# Altium schematic sheet 34. USB TYPE C 3.0.SchDoc: USB 3.0 TYPE C INTERFACE
size 513 x 386 mm; Project: PROC154E2(001)_SK_AM69; Issue: 1.0; RevCode: E3; Page Create Date: March  8, 1995; Variant Name: Core Design; Schematic Page Number: 34; Page Number: 34; Page Size: C; Comment: MISTRAL_TITLEBLK_CSIZE_1; Page Count: 62; Schematic Page Count: 62; Name: PROC154E2 001 SK AM69; DsnPath: C:\Users\danie\Downloads\sprr466c\PROC154E3_RP\PROC154E3_SCH.DSN; SchematicName: SCHEMATIC1; PageName: 34. USB TYPE C 3.0; PageSize: C; TopSchematic: True
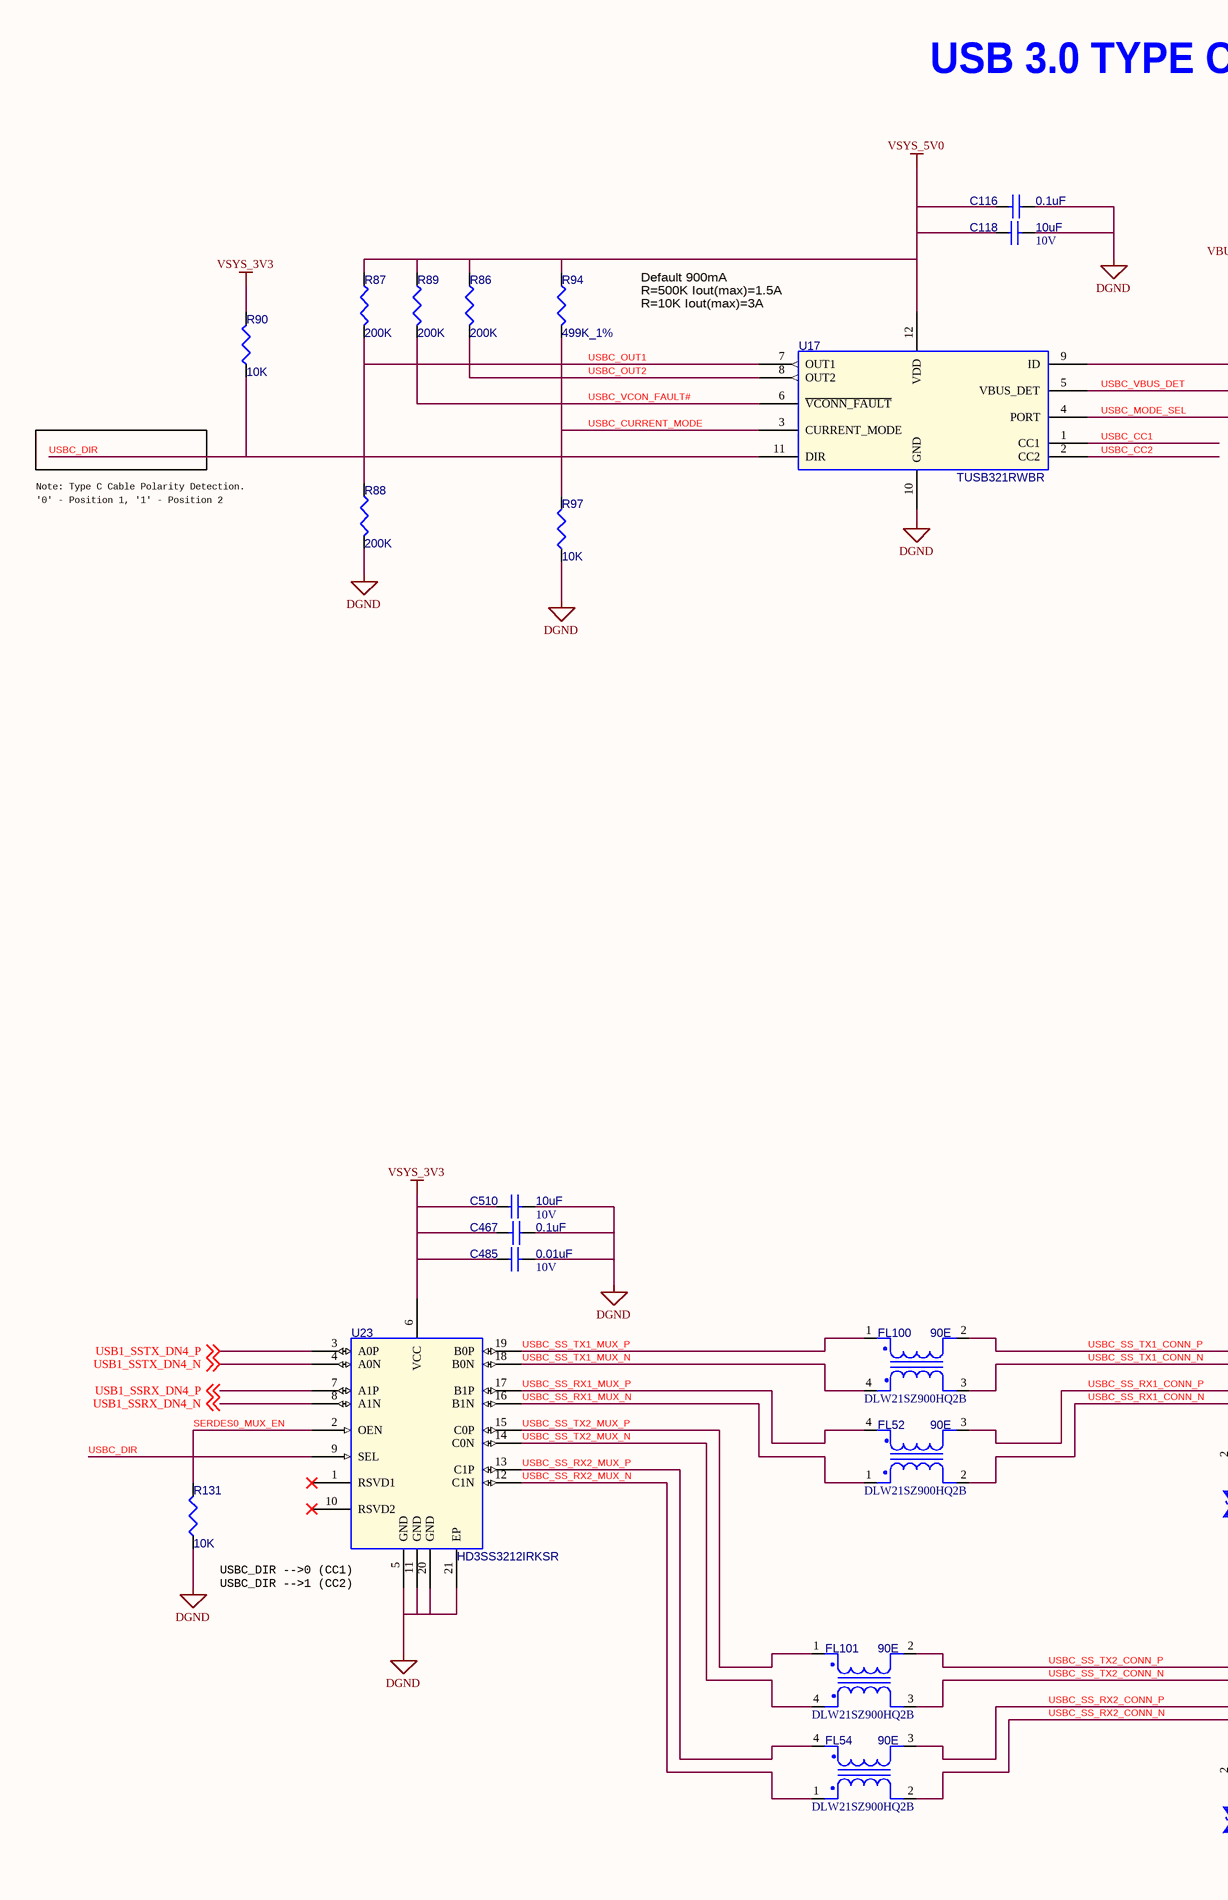
[diagram p0: 34. USB TYPE C 3.0.SchDoc, left]
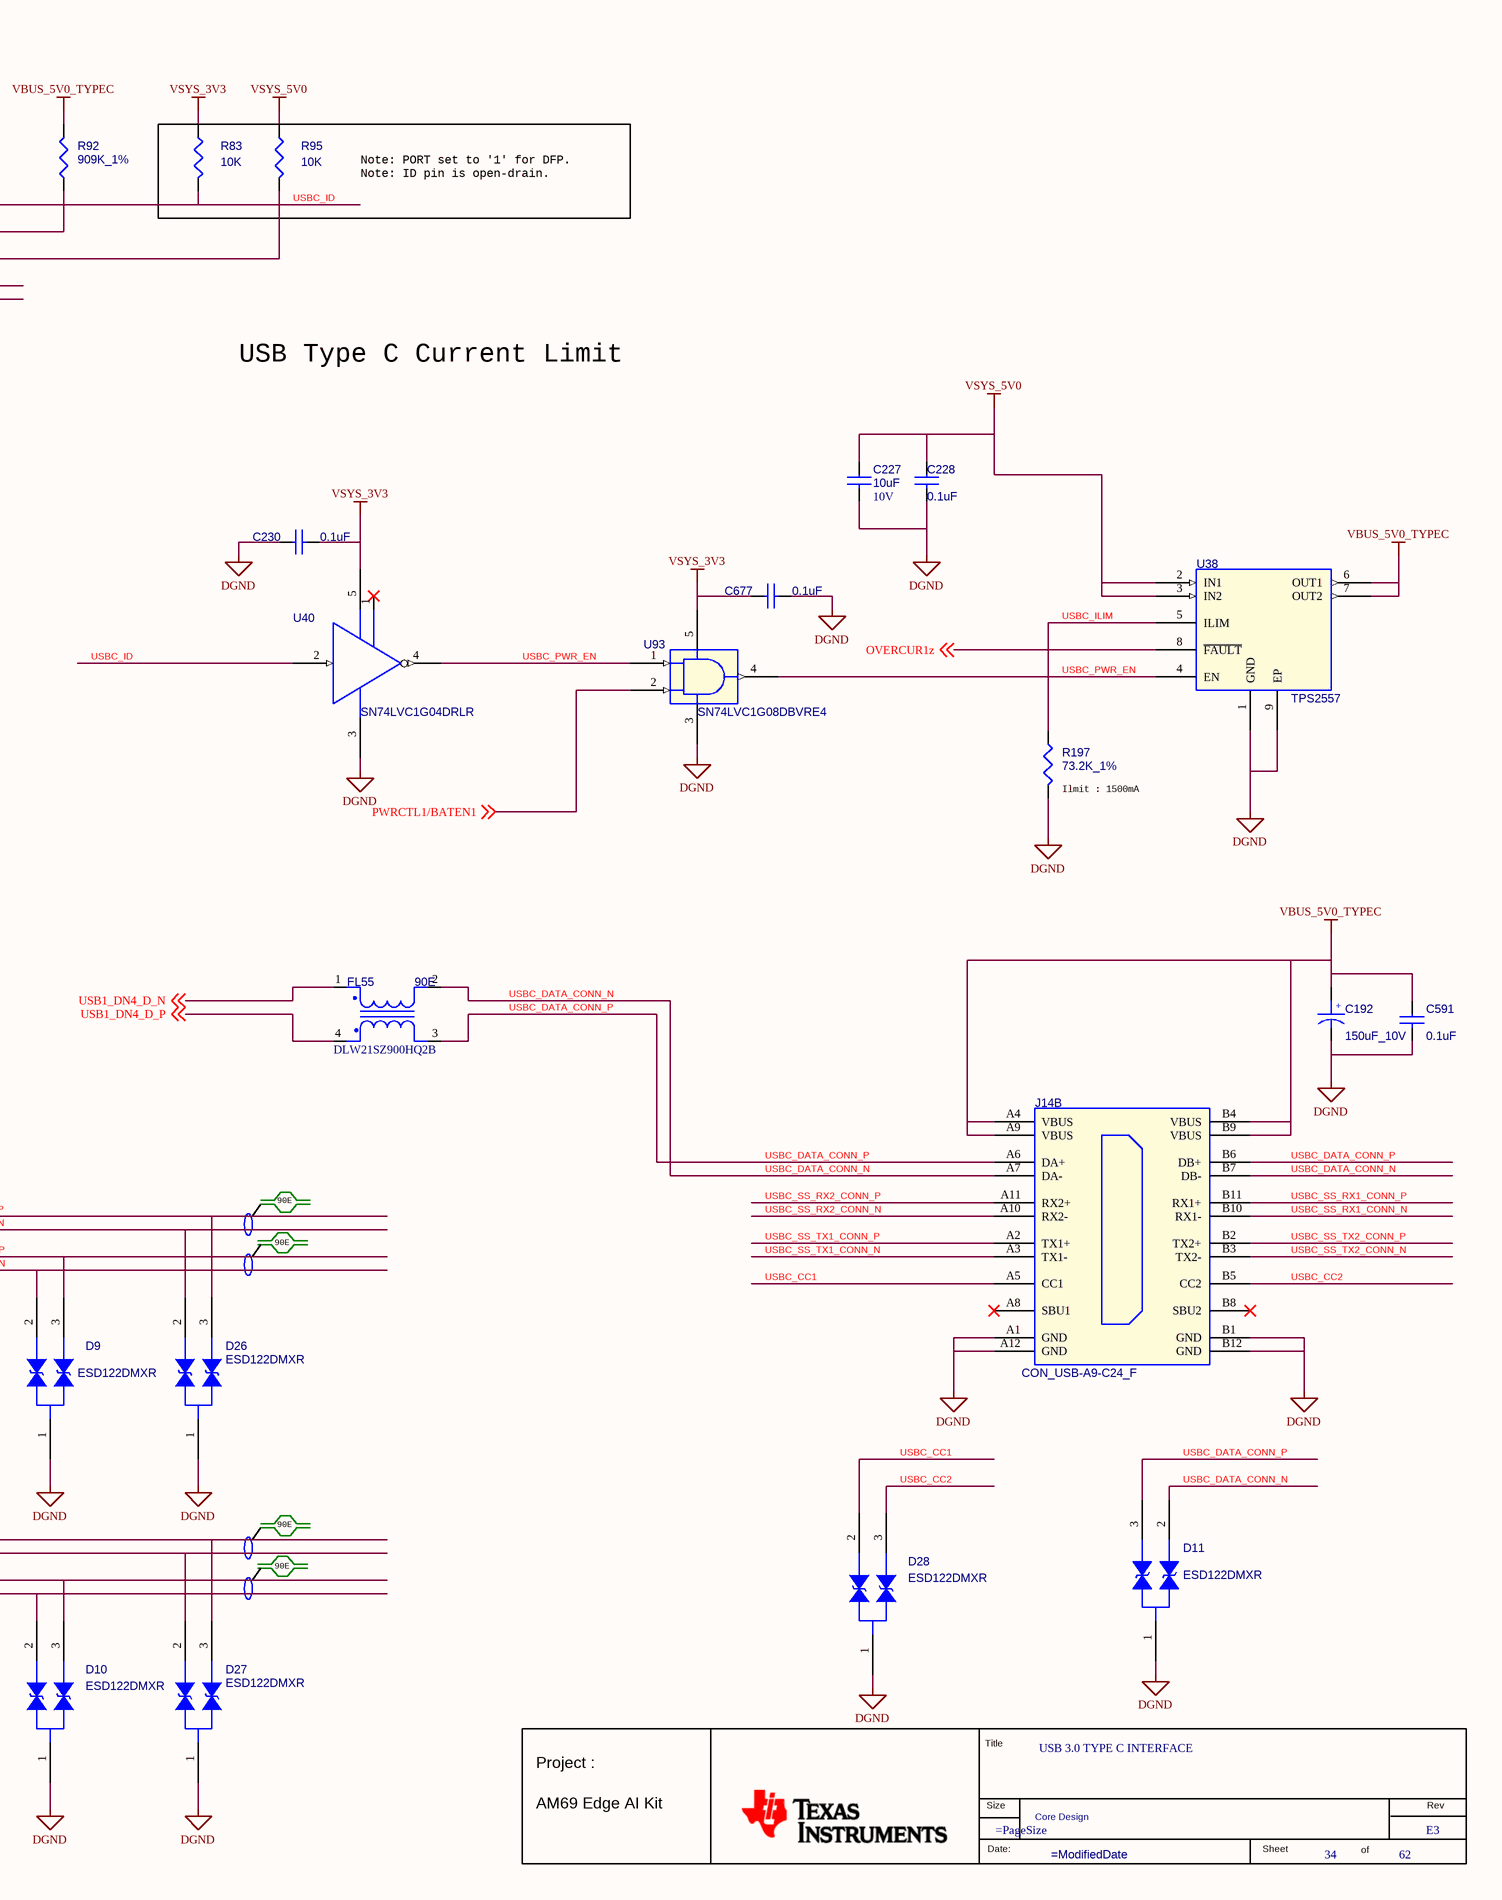
[diagram p1: 34. USB TYPE C 3.0.SchDoc, right]

## Parts
*  RevCode: E3  Title: USB 3.0 TYPE C INTERFACE  Page Number: 34  Page Count: 62  Variant Name: Core Design  (hidden comment: MISTRAL_TITLEBLK_CSIZE_1)  (graphical)
C116  0.1uF  [CAP0201_0-5]
C118  10uF  Voltage: 10V  [CAP0402_1]
C192  150uF_10V  [CAPT3528B_2-25]
C227  10uF  Voltage: 10V  [CAP0402_1]
C228  0.1uF  [CAP0201_0-5]
C230  0.1uF  [CAP0201_0-5]
C467  0.1uF  [CAP0201_0-5]
C485  0.01uF  Voltage: 10V  [CAP0201_0-5]
C510  10uF  Voltage: 10V  [CAP0402_1]
C591  0.1uF  [CAP0201_0-5]
C677  0.1uF  [CAP0201_0-5]
D9  ESD122DMXR  [X2SON3_ESD122DMX_30X40_0-4]
D10  ESD122DMXR  [X2SON3_ESD122DMX_30X40_0-4]
D11  ESD122DMXR  [X2SON3_ESD122DMX_30X40_0-4]
D26  ESD122DMXR  [X2SON3_ESD122DMX_30X40_0-4]
D27  ESD122DMXR  [X2SON3_ESD122DMX_30X40_0-4]
D28  ESD122DMXR  [X2SON3_ESD122DMX_30X40_0-4]
FL52  90E  Mfr_part_number: DLW21SZ900HQ2B  [IND4_DLW21H_90X60_SMD_1-4]
FL54  90E  Mfr_part_number: DLW21SZ900HQ2B  [IND4_DLW21H_90X60_SMD_1-4]
FL55  90E  Mfr_part_number: DLW21SZ900HQ2B  [IND4_DLW21H_90X60_SMD_1-4]
FL100  90E  Mfr_part_number: DLW21SZ900HQ2B  [IND4_DLW21H_90X60_SMD_1-4]
FL101  90E  Mfr_part_number: DLW21SZ900HQ2B  [IND4_DLW21H_90X60_SMD_1-4]
J14  CON_USB-A9-C24_F  [CON_USBAC33_USB-A3-C31-D-RA-CS1_S_R_T_15-9]  (part B of 2)
R83  10K  [RES0402_0-5]
R86  200K  [RES0402_0-5]
R87  200K  [RES0402_0-5]
R88  200K  [RES0402_0-5]
R89  200K  [RES0402_0-5]
R90  10K  [RES0201_0-5]
R92  909K_1%  [RES0402_0-5]
R94  499K_1%  [RES0402_0-5]
R95  10K  [RES0402_0-5]
R97  10K  [RES0402_0-5]
R131  10K  [RES0402_0-5]
R197  73.2K_1%  [RES0402_0-5]
U17  TUSB321RWBR  [X2QFN12_TUSB322I_60X60_0-4]
U23  HD3SS3212IRKSR  [VQFN20_HD3SS3212_100X180_1]
U38  TPS2557  [SON8_25-59_130X130_1]
U40  SN74LVC1G04DRLR  [SOT553-5]
U93  SN74LVC1G08DBVRE4  [SOT23-5]

## Nets
DGND: C116.1 C118.2 C192.2 C227.2 C228.2 C230.1 C467.1 C485.2 C510.2 C591.2 C677.2 D9.1(GND) D10.1(GND) D11.1(GND) D26.1(GND) D27.1(GND) D28.1(GND) J14.A1(GND) J14.A12(GND) J14.B1(GND) J14.B12(GND) R88.2 R97.1 R131.1 R197.2 U17.10(GND) U23.5(GND) U23.11(GND) U23.20(GND) U23.21(EP) U38.1(GND) U38.9(EP) U40.3(GND) U93.3(GND)
VBUS_5V0_TYPEC: C192.1 C591.1 J14.A4(VBUS) J14.A9(VBUS) J14.B4(VBUS) J14.B9(VBUS) R92.2 U38.6(OUT1) U38.7(OUT2)
VSYS_3V3: C230.2 C467.2 C485.1 C510.1 C677.1 R83.1 R90.2 U23.6(VCC) U40.5(VCC) U93.5(VCC)
VSYS_5V0: C116.2 C118.1 C227.1 C228.1 R86.1 R87.1 R89.1 R94.1 R95.1 U17.12(VDD) U38.2(IN1) U38.3(IN2)
OVERCUR1z: U38.8(~{FAULT}) ; off-sheet OVERCUR1z
PWRCTL1/BATEN1: U93.2(B) ; off-sheet PWRCTL1/BATEN1
SERDES0_MUX_EN: R131.2 U23.2(OEN)
USB1_DN4_D_N: FL55.1(IN1) ; off-sheet USB1_DN4_D_N
USB1_DN4_D_P: FL55.4(OUT2) ; off-sheet USB1_DN4_D_P
USB1_SSRX_DN4_N: U23.8(A1N) ; off-sheet USB1_SSRX_DN4_N
USB1_SSRX_DN4_P: U23.7(A1P) ; off-sheet USB1_SSRX_DN4_P
USB1_SSTX_DN4_N: U23.4(A0N) ; off-sheet USB1_SSTX_DN4_N
USB1_SSTX_DN4_P: U23.3(A0P) ; off-sheet USB1_SSTX_DN4_P
USBC_CC1: D28.2(IO1) J14.A5(CC1) U17.1(CC1)
USBC_CC2: D28.3(IO2) J14.B5(CC2) U17.2(CC2)
USBC_CURRENT_MODE: R94.2 R97.2 U17.3(CURRENT_MODE)
USBC_DATA_CONN_N: D11.2(IO1) FL55.2(IN2) J14.A7(DA-) J14.B7(DB-)
USBC_DATA_CONN_P: D11.3(IO2) FL55.3(OUT1) J14.A6(DA+) J14.B6(DB+)
USBC_DIR: R90.1 U17.11(DIR) U23.9(SEL)
USBC_ID: R83.2 U17.9(ID) U40.2(A)
USBC_ILIM: R197.1 U38.5(ILIM)
USBC_MODE_SEL: R95.2 U17.4(PORT)
USBC_OUT1: R87.2 R88.1 U17.7(OUT1)
USBC_OUT2: R86.2 U17.8(OUT2)
USBC_PWR_EN: U38.4(EN) U40.4(Y) U93.1(A) U93.4(Y)
USBC_SS_RX1_CONN_N: D9.2(IO1) FL52.2(IN2) J14.B10(RX1-)
USBC_SS_RX1_CONN_P: D9.3(IO2) FL52.3(OUT1) J14.B11(RX1+)
USBC_SS_RX1_MUX_N: FL52.1(IN1) U23.16(B1N)
USBC_SS_RX1_MUX_P: FL52.4(OUT2) U23.17(B1P)
USBC_SS_RX2_CONN_N: D10.2(IO1) FL54.2(IN2) J14.A10(RX2-)
USBC_SS_RX2_CONN_P: D10.3(IO2) FL54.3(OUT1) J14.A11(RX2+)
USBC_SS_RX2_MUX_N: FL54.1(IN1) U23.12(C1N)
USBC_SS_RX2_MUX_P: FL54.4(OUT2) U23.13(C1P)
USBC_SS_TX1_CONN_N: D26.2(IO1) FL100.3(OUT1) J14.A3(TX1-)
USBC_SS_TX1_CONN_P: D26.3(IO2) FL100.2(IN2) J14.A2(TX1+)
USBC_SS_TX1_MUX_N: FL100.4(OUT2) U23.18(B0N)
USBC_SS_TX1_MUX_P: FL100.1(IN1) U23.19(B0P)
USBC_SS_TX2_CONN_N: D27.2(IO1) FL101.3(OUT1) J14.B3(TX2-)
USBC_SS_TX2_CONN_P: D27.3(IO2) FL101.2(IN2) J14.B2(TX2+)
USBC_SS_TX2_MUX_N: FL101.4(OUT2) U23.14(C0N)
USBC_SS_TX2_MUX_P: FL101.1(IN1) U23.15(C0P)
USBC_VBUS_DET: R92.1 U17.5(VBUS_DET)
USBC_VCON_FAULT#: R89.2 U17.6(~{VCONN_FAULT})

Not connected (* = marked no-connect by the designer): J14 A8(SBU1)* B8(SBU2)*; U23 1(RSVD1)* 10(RSVD2)*; U40 1(NC)*

## Notes on the sheet
- USB 3.0 TYPE C INTERFACE
- R=500K Iout(max)=1.5A
- R=10K Iout(max)=3A
- Default 900mA
- Note: PORT set to '1' for DFP.
  Note: ID pin is open-drain.
- Note: Type C Cable Polarity Detection.
- '0' - Position 1, '1' - Position 2
- USB Type C Current Limit
- (near R197) Ilmit : 1500mA
- 90E
- (near U23) USBC_DIR -->0 (CC1)
  USBC_DIR -->1 (CC2)
- (in symbol CAP_POL) +
- (in symbol MISTRAL_TITLEBLK_CSIZE_1) Title; Project :; Size; Rev; AM69 Edge AI Kit; Date:; Sheet; of

## Library data of the parts
* = MISTRAL_TITLEBLK_CSIZE_1: Issue: 1.0; Project: PROC154E2(001)_SK_AM69; Name: PROC154E2 001 SK AM69; Page Create Date: March  8, 1995; Page Size: =PageSize; Page Modify Date: =ModifiedDate; Schematic Page Count: 62; Schematic Page Number: 34
C116 = CAP_Dup1: CAP CERAMIC 0.1uF 16V 10% X7S AUTO 0201; Part Reference: C116; Part_type: CAPACITORS\CERAMIC; Mfr_part_number: GRT033C71C104KE01D; Mfr_name: MURATA; Mistral Part No: 120021030007-R; Custom_Duty: 15%; Customs_HS_Code: 85322990; Wattage: NA; Project: J7ES_SK_BRD; Value: 0.1uF; MECHANICAL 3D STEP FILE: CAP0201_0-5; Chkd/date: MANIRAJA/110321; Crtd /date: ALVY/110321; Datasheet: Y:\MIS_DATABASE\DATASHEETS\CAPACITORS\GRT033C71C104KE01.PDF; Temperature: -55°C+125°C; Weight: 330mg; Height: 0.33MM; Distributor_part_number: 490-GRT033C71C104KE01DTR-ND; Distributor_name: DIGIKEY; Package: 0201; Voltage: 16V; Tolerance: 10%; PCB Footprint: CAP0201_0-5
C118 = CAP_Dup1: CAP CERAMIC 10uF 10V 20% X5R 0402; Part Reference: C118; Part_type: CAPACITORS\CERAMIC; Mfr_part_number: CL05A106MP8NUB8; Mfr_name: SAMSUNG; Mistral Part No: 120019020008-R; Custom_Duty: 15%; Customs_HS_Code: 85322990; Wattage: NA; Project: TI_60GHz-AOP; Value: 10uF; Footprint Path: Y:\MIS_DATABASE\Library\ALTIUM_TOOL\PCB_FOOTPRINTS\Altium_Footprint_Lib.PcbLib; Library Path: Y:\MIS_DATABASE\Library\ALTIUM_TOOL\SCHEMATICS_PARTS\MS_DISCRETE_Library.schlib; Footprint Ref: CAP0402_1; Library Ref: CAP; MECHANICAL 3D STEP FILE: CAP0402_1; Chkd/date: MANIRAJA/150219; Crtd /date: ALVY/150219; Datasheet: Y:\MIS_DATABASE\DATASHEETS\CAPACITORS\CL05A106MP8NUB8.PDF; Temperature: -55°C+85°C; Weight: NA; Height: 0.90MM; Distributor_part_number: 1276-6830-1-ND; Distributor_name: DIGIKEY; Package: 0402; Tolerance: 20%; PCB Footprint: CAP0402_1
C192 = CAP_POL: CAP TANTALUM 150uF 10V 20% ESR 500mE B3528; Part Reference: C192; Part_type: CAPACITORS\TANTALUM; Mfr_part_number: TLJB157M010R0500; Mfr_name: AVX CORPORATION; Mistral Part No: 120015050001-R; Custom_Duty: 15%; Customs_HS_Code: 85322990; Wattage: NA; Project: MED CARD; Value: 150uF_10V; Footprint Path: Y:\MIS_DATABASE\Library\ALTIUM_TOOL\PCB_FOOTPRINTS\Altium_Footprint_Lib.PcbLib; Library Path: Y:\MIS_DATABASE\Library\ALTIUM_TOOL\SCHEMATICS_PARTS\MS_DISCRETE_Library.schlib; Footprint Ref: CAPT3528B_2-25; MECHANICAL 3D STEP FILE: CAPT3528B_2-25; Chkd/date: NAVEED/060515; Crtd /date: VASANTHA/040515; Datasheet: Y:\MIS_DATABASE\DATASHEETS\CAPACITORS\TLJ_SERIES.PDF; Temperature: -55°C+125°C; Weight: NA; Height: 2.10MM; Library Ref: CAP_POL; Distributor_part_number: 478-3349-1-ND; Distributor_name: DIGIKEY; Package: B3528; Voltage: 10V; Tolerance: 20%; PCB Footprint: CAPT3528B_2-25
C227 = CAP_Dup1: CAP CERAMIC 10uF 10V 20% X5R 0402; Part Reference: C227; Part_type: CAPACITORS\CERAMIC; Mfr_part_number: CL05A106MP8NUB8; Mfr_name: SAMSUNG; Mistral Part No: 120019020008-R; Custom_Duty: 15%; Customs_HS_Code: 85322990; Wattage: NA; Project: TI_60GHz-AOP; Value: 10uF; MECHANICAL 3D STEP FILE: CAP0402_1; Footprint Path: Y:\MIS_DATABASE\Library\ALTIUM_TOOL\PCB_FOOTPRINTS\Altium_Footprint_Lib.PcbLib; Library Path: Y:\MIS_DATABASE\Library\ALTIUM_TOOL\SCHEMATICS_PARTS\MS_DISCRETE_Library.schlib; Chkd/date: MANIRAJA/150219; Crtd /date: ALVY/150219; Datasheet: Y:\MIS_DATABASE\DATASHEETS\CAPACITORS\CL05A106MP8NUB8.PDF; Temperature: -55°C+85°C; Weight: NA; Height: 0.90MM; Library Ref: CAP; Distributor_part_number: 1276-6830-1-ND; Distributor_name: DIGIKEY; Package: 0402; Tolerance: 20%; Footprint Ref: CAP0402_1; PCB Footprint: CAP0402_1
C228 = CAP_Dup1: CAP CERAMIC 0.1uF 16V 10% X7S AUTO 0201; Part Reference: C228; Part_type: CAPACITORS\CERAMIC; Mfr_part_number: GRT033C71C104KE01D; Mfr_name: MURATA; Mistral Part No: 120021030007-R; Custom_Duty: 15%; Customs_HS_Code: 85322990; Wattage: NA; Project: J7ES_SK_BRD; Value: 0.1uF; MECHANICAL 3D STEP FILE: CAP0201_0-5; Chkd/date: MANIRAJA/110321; Crtd /date: ALVY/110321; Datasheet: Y:\MIS_DATABASE\DATASHEETS\CAPACITORS\GRT033C71C104KE01.PDF; Temperature: -55°C+125°C; Weight: 330mg; Height: 0.33MM; Distributor_part_number: 490-GRT033C71C104KE01DTR-ND; Distributor_name: DIGIKEY; Package: 0201; Voltage: 16V; Tolerance: 10%; PCB Footprint: CAP0201_0-5
C230 = CAP_Dup1: CAP CERAMIC 0.1uF 16V 10% X7S AUTO 0201; Part Reference: C230; Mistral Part No: 120021030007-R; Mfr_name: MURATA; Mfr_part_number: GRT033C71C104KE01D; Part_type: CAPACITORS\CERAMIC; Project: J7ES_SK_BRD; Wattage: NA; Customs_HS_Code: 85322990; Custom_Duty: 15%; Value: 0.1uF; Tolerance: 10%; Voltage: 16V; Package: 0201; Distributor_name: DIGIKEY; Distributor_part_number: 490-GRT033C71C104KE01DTR-ND; Height: 0.33MM; Weight: 330mg; Temperature: -55°C+125°C; Datasheet: Y:\MIS_DATABASE\DATASHEETS\CAPACITORS\GRT033C71C104KE01.PDF; Crtd /date: ALVY/110321; Chkd/date: MANIRAJA/110321; MECHANICAL 3D STEP FILE: CAP0201_0-5; PCB Footprint: CAP0201_0-5
C467 = CAP_Dup1: CAP CERAMIC 0.1uF 16V 10% X7S AUTO 0201; Part Reference: C467; Mistral Part No: 120021030007-R; Mfr_name: MURATA; Mfr_part_number: GRT033C71C104KE01D; Part_type: CAPACITORS\CERAMIC; Project: J7ES_SK_BRD; Wattage: NA; Customs_HS_Code: 85322990; Custom_Duty: 15%; Value: 0.1uF; Tolerance: 10%; Voltage: 16V; Package: 0201; Distributor_name: DIGIKEY; Distributor_part_number: 490-GRT033C71C104KE01DTR-ND; Height: 0.33MM; Weight: 330mg; Temperature: -55°C+125°C; Datasheet: Y:\MIS_DATABASE\DATASHEETS\CAPACITORS\GRT033C71C104KE01.PDF; Crtd /date: ALVY/110321; Chkd/date: MANIRAJA/110321; MECHANICAL 3D STEP FILE: CAP0201_0-5; PCB Footprint: CAP0201_0-5
C485 = CAP_Dup1: CAP CERAMIC 0.01uF 10V 10% X5R 0201; Part Reference: C485; Part_type: CAPACITORS\CERAMIC; Mfr_part_number: GRM033R61A103KA01D; Mfr_name: MURATA; Mistral Part No: 120011010015-R; Custom_Duty: 15%; Customs_HS_Code: 85322990; Wattage: NA; Project: VMEFMCD; Value: 0.01uF; Footprint Path: Y:\MIS_DATABASE\Library\ALTIUM_TOOL\PCB_FOOTPRINTS\Altium_Footprint_Lib.PcbLib; Library Path: Y:\MIS_DATABASE\Library\ALTIUM_TOOL\SCHEMATICS_PARTS\MS_DISCRETE_Library.schlib; MECHANICAL 3D STEP FILE: CAP0201_0-5; Chkd/date: VASANTHA/270117; Crtd /date: MAZHAR/090909; Datasheet: Y:\MIS_DATABASE\DATASHEETS\CAPACITORS\MURATA-GXX-SER_NOV17.PDF; Temperature: -55°C+85°C; Weight: 0.33mg; Height: 0.33MM; Library Ref: CAP; Distributor_part_number: 490-3166-1-ND; Distributor_name: DIGIKEY; Package: 0201; Tolerance: 10%; Footprint Ref: CAP0201_0-5; PCB Footprint: CAP0201_0-5
C510 = CAP_Dup1: CAP CERAMIC 10uF 10V 20% X5R 0402; Part Reference: C510; Part_type: CAPACITORS\CERAMIC; Mfr_part_number: CL05A106MP8NUB8; Mfr_name: SAMSUNG; Mistral Part No: 120019020008-R; Custom_Duty: 15%; Customs_HS_Code: 85322990; Wattage: NA; Project: TI_60GHz-AOP; Value: 10uF; Footprint Path: Y:\MIS_DATABASE\Library\ALTIUM_TOOL\PCB_FOOTPRINTS\Altium_Footprint_Lib.PcbLib; Library Path: Y:\MIS_DATABASE\Library\ALTIUM_TOOL\SCHEMATICS_PARTS\MS_DISCRETE_Library.schlib; Footprint Ref: CAP0402_1; Library Ref: CAP; MECHANICAL 3D STEP FILE: CAP0402_1; Chkd/date: MANIRAJA/150219; Crtd /date: ALVY/150219; Datasheet: Y:\MIS_DATABASE\DATASHEETS\CAPACITORS\CL05A106MP8NUB8.PDF; Temperature: -55°C+85°C; Weight: NA; Height: 0.90MM; Distributor_part_number: 1276-6830-1-ND; Distributor_name: DIGIKEY; Package: 0402; Tolerance: 20%; PCB Footprint: CAP0402_1
C591 = CAP_Dup1: CAP CERAMIC 0.1uF 16V 10% X7S AUTO 0201; Part Reference: C591; Part_type: CAPACITORS\CERAMIC; Mfr_part_number: GRT033C71C104KE01D; Mfr_name: MURATA; Mistral Part No: 120021030007-R; Custom_Duty: 15%; Customs_HS_Code: 85322990; Wattage: NA; Project: J7ES_SK_BRD; Value: 0.1uF; MECHANICAL 3D STEP FILE: CAP0201_0-5; Chkd/date: MANIRAJA/110321; Crtd /date: ALVY/110321; Datasheet: Y:\MIS_DATABASE\DATASHEETS\CAPACITORS\GRT033C71C104KE01.PDF; Temperature: -55°C+125°C; Weight: 330mg; Height: 0.33MM; Distributor_part_number: 490-GRT033C71C104KE01DTR-ND; Distributor_name: DIGIKEY; Package: 0201; Voltage: 16V; Tolerance: 10%; PCB Footprint: CAP0201_0-5
C677 = CAP_Dup1: CAP CERAMIC 0.1uF 16V 10% X7S AUTO 0201; Part Reference: C677; Mistral Part No: 120021030007-R; Mfr_name: MURATA; Mfr_part_number: GRT033C71C104KE01D; Part_type: CAPACITORS\CERAMIC; Project: J7ES_SK_BRD; Wattage: NA; Customs_HS_Code: 85322990; Custom_Duty: 15%; Value: 0.1uF; Tolerance: 10%; Voltage: 16V; Package: 0201; Distributor_name: DIGIKEY; Distributor_part_number: 490-GRT033C71C104KE01DTR-ND; Height: 0.33MM; Weight: 330mg; Temperature: -55°C+125°C; Datasheet: Y:\MIS_DATABASE\DATASHEETS\CAPACITORS\GRT033C71C104KE01.PDF; Crtd /date: ALVY/110321; Chkd/date: MANIRAJA/110321; MECHANICAL 3D STEP FILE: CAP0201_0-5; PCB Footprint: CAP0201_0-5
D9 = DIODE_ESD122DMXR: DIODE 2-CH ESD PROTECTION FOR USB TYPE-C AND HDMI 2.0 X2SON-3; Part Reference: D9; Mistral Part No: 130017080015-R; Mfr_name: TEXAS INSTRUMENTS; Part_type: DIODE\TVS; Project: TI_SVB_CONTROLLER CARD; Tolerance: NA; Customs_HS_Code: 85412900; Custom_Duty: 15%; Value: ESD122DMXR; PCB Footprint: X2SON3_ESD122DMX_30X40_0-4; Mfr_part_number: ESD122DMXR; Voltage: NA; Wattage: NA; Package: X2SON-3; Distributor_name: DIGIKEY; Distributor_part_number: ESD122DMXR-ND; Library Ref: DIODE_ESD122DMXR; Height: 0.40MM; Weight: NA; Temperature: -40°C+125°C; Datasheet: Y:\MIS_DATABASE\DATASHEETS\DISCRETES\DIODES\ESD122XX.PDF; Crtd /date: MANIRAJA/140817; Chkd/date: MANIRAJA/140817; MECHANICAL 3D STEP FILE: X2SON3_ESD122DMX_30X40_0-4
D10 = DIODE_ESD122DMXR: DIODE 2-CH ESD PROTECTION FOR USB TYPE-C AND HDMI 2.0 X2SON-3; Part Reference: D10; Mistral Part No: 130017080015-R; Mfr_name: TEXAS INSTRUMENTS; Part_type: DIODE\TVS; Project: TI_SVB_CONTROLLER CARD; Tolerance: NA; Customs_HS_Code: 85412900; Custom_Duty: 15%; Value: ESD122DMXR; PCB Footprint: X2SON3_ESD122DMX_30X40_0-4; Mfr_part_number: ESD122DMXR; Voltage: NA; Wattage: NA; Package: X2SON-3; Distributor_name: DIGIKEY; Distributor_part_number: ESD122DMXR-ND; Library Ref: DIODE_ESD122DMXR; Height: 0.40MM; Weight: NA; Temperature: -40°C+125°C; Datasheet: Y:\MIS_DATABASE\DATASHEETS\DISCRETES\DIODES\ESD122XX.PDF; Crtd /date: MANIRAJA/140817; Chkd/date: MANIRAJA/140817; MECHANICAL 3D STEP FILE: X2SON3_ESD122DMX_30X40_0-4
D11 = DIODE_ESD122DMXR: DIODE 2-CH ESD PROTECTION FOR USB TYPE-C AND HDMI 2.0 X2SON-3; Part Reference: D11; Mistral Part No: 130017080015-R; Mfr_name: TEXAS INSTRUMENTS; Part_type: DIODE\TVS; Project: TI_SVB_CONTROLLER CARD; Tolerance: NA; Customs_HS_Code: 85412900; Custom_Duty: 15%; Value: ESD122DMXR; PCB Footprint: X2SON3_ESD122DMX_30X40_0-4; Mfr_part_number: ESD122DMXR; Voltage: NA; Wattage: NA; Package: X2SON-3; Distributor_name: DIGIKEY; Distributor_part_number: ESD122DMXR-ND; Library Ref: DIODE_ESD122DMXR; Height: 0.40MM; Weight: NA; Temperature: -40°C+125°C; Datasheet: Y:\MIS_DATABASE\DATASHEETS\DISCRETES\DIODES\ESD122XX.PDF; Crtd /date: MANIRAJA/140817; Chkd/date: MANIRAJA/140817; MECHANICAL 3D STEP FILE: X2SON3_ESD122DMX_30X40_0-4
D26 = DIODE_ESD122DMXR: DIODE 2-CH ESD PROTECTION FOR USB TYPE-C AND HDMI 2.0 X2SON-3; Part Reference: D26; Part_type: DIODE\TVS; Mfr_name: TEXAS INSTRUMENTS; Mistral Part No: 130017080015-R; Custom_Duty: 15%; Customs_HS_Code: 85412900; Wattage: NA; Project: TI_SVB_CONTROLLER CARD; Value: ESD122DMXR; PCB Footprint: X2SON3_ESD122DMX_30X40_0-4; MECHANICAL 3D STEP FILE: X2SON3_ESD122DMX_30X40_0-4; Chkd/date: MANIRAJA/140817; Crtd /date: MANIRAJA/140817; Datasheet: Y:\MIS_DATABASE\DATASHEETS\DISCRETES\DIODES\ESD122XX.PDF; Temperature: -40°C+125°C; Weight: NA; Height: 0.40MM; Library Ref: DIODE_ESD122DMXR; Distributor_part_number: ESD122DMXR-ND; Distributor_name: DIGIKEY; Package: X2SON-3; Voltage: NA; Tolerance: NA; Mfr_part_number: ESD122DMXR
D27 = DIODE_ESD122DMXR: DIODE 2-CH ESD PROTECTION FOR USB TYPE-C AND HDMI 2.0 X2SON-3; Part Reference: D27; Mistral Part No: 130017080015-R; Mfr_name: TEXAS INSTRUMENTS; Part_type: DIODE\TVS; Project: TI_SVB_CONTROLLER CARD; Tolerance: NA; Customs_HS_Code: 85412900; Custom_Duty: 15%; Value: ESD122DMXR; PCB Footprint: X2SON3_ESD122DMX_30X40_0-4; Mfr_part_number: ESD122DMXR; Voltage: NA; Wattage: NA; Package: X2SON-3; Distributor_name: DIGIKEY; Distributor_part_number: ESD122DMXR-ND; Library Ref: DIODE_ESD122DMXR; Height: 0.40MM; Weight: NA; Temperature: -40°C+125°C; Datasheet: Y:\MIS_DATABASE\DATASHEETS\DISCRETES\DIODES\ESD122XX.PDF; Crtd /date: MANIRAJA/140817; Chkd/date: MANIRAJA/140817; MECHANICAL 3D STEP FILE: X2SON3_ESD122DMX_30X40_0-4
D28 = DIODE_ESD122DMXR: DIODE 2-CH ESD PROTECTION FOR USB TYPE-C AND HDMI 2.0 X2SON-3; Part Reference: D28; Part_type: DIODE\TVS; Mfr_name: TEXAS INSTRUMENTS; Mistral Part No: 130017080015-R; Custom_Duty: 15%; Customs_HS_Code: 85412900; Wattage: NA; Project: TI_SVB_CONTROLLER CARD; Value: ESD122DMXR; MECHANICAL 3D STEP FILE: X2SON3_ESD122DMX_30X40_0-4; Chkd/date: MANIRAJA/140817; Crtd /date: MANIRAJA/140817; Datasheet: Y:\MIS_DATABASE\DATASHEETS\DISCRETES\DIODES\ESD122XX.PDF; Temperature: -40°C+125°C; Weight: NA; Height: 0.40MM; Library Ref: DIODE_ESD122DMXR; Distributor_part_number: ESD122DMXR-ND; Distributor_name: DIGIKEY; Package: X2SON-3; Voltage: NA; Tolerance: NA; Mfr_part_number: ESD122DMXR; PCB Footprint: X2SON3_ESD122DMX_30X40_0-4
FL52 = INDUCTOR_DLW31S: IND COMMON MODE CHOKE 90E 280mA SMD; Part Reference: FL52; Mistral Part No: 130019060035-R; Mfr_name: MURATA; Project: TI_J7ES_CP; Tolerance: NA; Customs_HS_Code: 85437099; Custom_Duty: 24%; SIGNAL_MODEL: INDUCTOR_DLW31S_IND4_DLW21H_90X_90E; Value: 90E; Footprint Ref: IND4_DLW21H_90X60_SMD_1-4; Part_type: INDUCTOR; Voltage: NA; Wattage: NA; Package: SMD; Distributor_name: NA; Distributor_part_number: NA; Library Ref: INDUCTOR_DLW31S; Height: 1.40MM; Weight: 11mg; Temperature: -40°C+105°C; Datasheet: Y:\MIS_DATABASE\DATASHEETS\DISCRETES\INDUCTORS\DLW21SZ900HQ2B.PDF; Crtd /date: MANIRAJA/270619; Chkd/date: MANIRAJA/270619; MECHANICAL 3D STEP FILE: IND4_DLW21H_90X60_SMD_1-4; Library Path: Y:\MIS_DATABASE\Library\ALTIUM_TOOL\SCHEMATICS_PARTS\MS_DISCRETE_Library.schlib; Footprint Path: Y:\MIS_DATABASE\Library\ALTIUM_TOOL\PCB_FOOTPRINTS\Altium_Footprint_Lib.PcbLib; PCB Footprint: IND4_DLW21H_90X60_SMD_1-4
FL54 = INDUCTOR_DLW31S: IND COMMON MODE CHOKE 90E 280mA SMD; Part Reference: FL54; Mistral Part No: 130019060035-R; Mfr_name: MURATA; Project: TI_J7ES_CP; Tolerance: NA; Customs_HS_Code: 85437099; Custom_Duty: 24%; SIGNAL_MODEL: INDUCTOR_DLW31S_IND4_DLW21H_90X_90E; Value: 90E; Footprint Ref: IND4_DLW21H_90X60_SMD_1-4; Part_type: INDUCTOR; Voltage: NA; Wattage: NA; Package: SMD; Distributor_name: NA; Distributor_part_number: NA; Library Ref: INDUCTOR_DLW31S; Height: 1.40MM; Weight: 11mg; Temperature: -40°C+105°C; Datasheet: Y:\MIS_DATABASE\DATASHEETS\DISCRETES\INDUCTORS\DLW21SZ900HQ2B.PDF; Crtd /date: MANIRAJA/270619; Chkd/date: MANIRAJA/270619; MECHANICAL 3D STEP FILE: IND4_DLW21H_90X60_SMD_1-4; Library Path: Y:\MIS_DATABASE\Library\ALTIUM_TOOL\SCHEMATICS_PARTS\MS_DISCRETE_Library.schlib; Footprint Path: Y:\MIS_DATABASE\Library\ALTIUM_TOOL\PCB_FOOTPRINTS\Altium_Footprint_Lib.PcbLib; PCB Footprint: IND4_DLW21H_90X60_SMD_1-4
FL55 = INDUCTOR_DLW31S: IND COMMON MODE CHOKE 90E 280mA SMD; Part Reference: FL55; Mistral Part No: 130019060035-R; Mfr_name: MURATA; Project: TI_J7ES_CP; Tolerance: NA; Customs_HS_Code: 85437099; Custom_Duty: 24%; SIGNAL_MODEL: INDUCTOR_DLW31S_IND4_DLW21H_90X_90E; Value: 90E; PCB Footprint: IND4_DLW21H_90X60_SMD_1-4; Footprint Ref: IND4_DLW21H_90X60_SMD_1-4; Part_type: INDUCTOR; Voltage: NA; Wattage: NA; Package: SMD; Distributor_name: NA; Distributor_part_number: NA; Library Ref: INDUCTOR_DLW31S; Height: 1.40MM; Weight: 11mg; Temperature: -40°C+105°C; Datasheet: Y:\MIS_DATABASE\DATASHEETS\DISCRETES\INDUCTORS\DLW21SZ900HQ2B.PDF; Crtd /date: MANIRAJA/270619; Chkd/date: MANIRAJA/270619; MECHANICAL 3D STEP FILE: IND4_DLW21H_90X60_SMD_1-4; Library Path: Y:\MIS_DATABASE\Library\ALTIUM_TOOL\SCHEMATICS_PARTS\MS_DISCRETE_Library.schlib; Footprint Path: Y:\MIS_DATABASE\Library\ALTIUM_TOOL\PCB_FOOTPRINTS\Altium_Footprint_Lib.PcbLib
FL100 = INDUCTOR_DLW31S: IND COMMON MODE CHOKE 90E 280mA SMD; Part Reference: FL100; Mistral Part No: 130019060035-R; Mfr_name: MURATA; Project: TI_J7ES_CP; Tolerance: NA; Customs_HS_Code: 85437099; Custom_Duty: 24%; SIGNAL_MODEL: INDUCTOR_DLW31S_IND4_DLW21H_90X_90E; Value: 90E; Footprint Ref: IND4_DLW21H_90X60_SMD_1-4; Part_type: INDUCTOR; Voltage: NA; Wattage: NA; Package: SMD; Distributor_name: NA; Distributor_part_number: NA; Library Ref: INDUCTOR_DLW31S; Height: 1.40MM; Weight: 11mg; Temperature: -40°C+105°C; Datasheet: Y:\MIS_DATABASE\DATASHEETS\DISCRETES\INDUCTORS\DLW21SZ900HQ2B.PDF; Crtd /date: MANIRAJA/270619; Chkd/date: MANIRAJA/270619; MECHANICAL 3D STEP FILE: IND4_DLW21H_90X60_SMD_1-4; Library Path: Y:\MIS_DATABASE\Library\ALTIUM_TOOL\SCHEMATICS_PARTS\MS_DISCRETE_Library.schlib; Footprint Path: Y:\MIS_DATABASE\Library\ALTIUM_TOOL\PCB_FOOTPRINTS\Altium_Footprint_Lib.PcbLib; PCB Footprint: IND4_DLW21H_90X60_SMD_1-4
FL101 = INDUCTOR_DLW31S: IND COMMON MODE CHOKE 90E 280mA SMD; Part Reference: FL101; Mistral Part No: 130019060035-R; Mfr_name: MURATA; Project: TI_J7ES_CP; Tolerance: NA; Customs_HS_Code: 85437099; Custom_Duty: 24%; SIGNAL_MODEL: INDUCTOR_DLW31S_IND4_DLW21H_90X_90E; Value: 90E; Footprint Ref: IND4_DLW21H_90X60_SMD_1-4; Part_type: INDUCTOR; Voltage: NA; Wattage: NA; Package: SMD; Distributor_name: NA; Distributor_part_number: NA; Library Ref: INDUCTOR_DLW31S; Height: 1.40MM; Weight: 11mg; Temperature: -40°C+105°C; Datasheet: Y:\MIS_DATABASE\DATASHEETS\DISCRETES\INDUCTORS\DLW21SZ900HQ2B.PDF; Crtd /date: MANIRAJA/270619; Chkd/date: MANIRAJA/270619; MECHANICAL 3D STEP FILE: IND4_DLW21H_90X60_SMD_1-4; Library Path: Y:\MIS_DATABASE\Library\ALTIUM_TOOL\SCHEMATICS_PARTS\MS_DISCRETE_Library.schlib; Footprint Path: Y:\MIS_DATABASE\Library\ALTIUM_TOOL\PCB_FOOTPRINTS\Altium_Footprint_Lib.PcbLib; PCB Footprint: IND4_DLW21H_90X60_SMD_1-4
J14 = CON_USB-A9-C24_F: CON USB-A TYPE 9POS AND USB-C TYPE 24POS STACKED FEMALE RT TH; Part Reference: J14; Mistral Part No: 150021020043-R; Mfr_name: ADAM TECH; Mfr_part_number: USB-A3-C31-D-RA-CS1; Part_type: CONNECTOR\USB; Project: J7ES_SK_BRD; Tolerance: NA; Customs_HS_Code: 85369090; Custom_Duty: 24%; Value: CON_USB-A9-C24_F; Voltage: NA; Wattage: NA; Package: THRU-HOLE; Distributor_name: DIGIKEY; Distributor_part_number: 2057-USB-A3-C31-D-RA-CS1-ND; Library Ref: CON_USB-A9-C24_F; Footprint Ref: CON_USBAC33_USB-A3-C31-D-RA-CS1_S_R_T_15-9; Height: 15.88MM; Weight: NA; Temperature: -30°C+85°C; Datasheet: Y:\MIS_DATABASE\DATASHEETS\CONNECTORS\USB-A3-C31-D-RA-CS1.PDF; Crtd /date: ALVY/110221; Chkd/date: MANIRAJA/110221; MECHANICAL 3D STEP FILE: CON_USBAC33_USB-A3-C31-D-RA-CS1_S_R_T_15-9; Library Path: Y:\MIS_DATABASE\Library\ALTIUM_TOOL\SCHEMATICS_PARTS\MS_CONNECTOR_Library.schlib; Footprint Path: Y:\MIS_DATABASE\Library\ALTIUM_TOOL\PCB_FOOTPRINTS\Altium_Footprint_Lib.PcbLib; PCB Footprint: CON_USBAC33_USB-A3-C31-D-RA-CS1_S_R_T_15-9
R83 = RESISTOR_Dup2: RES 10K 1/16W 5% 0402; Part Reference: R83; Mistral Part No: 110011060021-R; Mfr_name: YAGEO AMERICA; Mfr_part_number: RC0402JR-0710KL; Part_type: RESISTORS\FIXED; Project: HSE; Voltage: NA; Customs_HS_Code: 85332119; Custom_Duty: 15%; Value: 10K; MECHANICAL 3D STEP FILE: RES0402_0-5; Tolerance: 5%; Wattage: 1/16W; Package: 0402; Distributor_name: DIGIKEY; Distributor_part_number: 311-10KJRCT-ND; Height: 0.40MM; Weight: 0.65mg; Temperature: -55°C+155°C; Datasheet: Y:\MIS_DATABASE\DATASHEETS\RESISTORS\RCXXXXL-SER_MAR18.PDF; Crtd /date: MAZHAR/230805; Chkd/date: VASANTHA/061216; Library Ref: RESISTOR; Footprint Ref: RES0402_0-5; Library Path: Y:\MIS_DATABASE\Library\ALTIUM_TOOL\SCHEMATICS_PARTS\MS_DISCRETE_Library.schlib; Footprint Path: Y:\MIS_DATABASE\Library\ALTIUM_TOOL\PCB_FOOTPRINTS\Altium_Footprint_Lib.PcbLib; PCB Footprint: RES0402_0-5
R86 = RESISTOR_Dup2: RES 200K 1/10W 5% 0402; Part Reference: R86; Mistral Part No: 110013100006-R; Mfr_name: PANASONIC-ECG; Mfr_part_number: ERJ-2GEJ204X; Part_type: RESISTORS\FIXED; Project: C-BAND_SYNTH; Voltage: NA; Customs_HS_Code: 85332119; Custom_Duty: 15%; Value: 200K; Footprint Ref: RES0402_0-5; Tolerance: 5%; Wattage: 1/10W; Package: 0402; Distributor_name: DIGIKEY; Distributor_part_number: P200KJCT-ND; Library Ref: RESISTOR; Height: 0.40MM; Weight: 0.8mg; Temperature: -55°C+155°C; Datasheet: Y:\MIS_DATABASE\DATASHEETS\RESISTORS\PAN-ERJSER_NOV17.PDF; Crtd /date: USMAN/151013; Chkd/date: MANOJ/230414; MECHANICAL 3D STEP FILE: RES0402_0-5; Library Path: Y:\MIS_DATABASE\Library\ALTIUM_TOOL\SCHEMATICS_PARTS\MS_DISCRETE_Library.schlib; Footprint Path: Y:\MIS_DATABASE\Library\ALTIUM_TOOL\PCB_FOOTPRINTS\Altium_Footprint_Lib.PcbLib; PCB Footprint: RES0402_0-5
R87 = RESISTOR_Dup2: RES 200K 1/10W 5% 0402; Part Reference: R87; Mistral Part No: 110013100006-R; Mfr_name: PANASONIC-ECG; Mfr_part_number: ERJ-2GEJ204X; Part_type: RESISTORS\FIXED; Project: C-BAND_SYNTH; Voltage: NA; Customs_HS_Code: 85332119; Custom_Duty: 15%; Value: 200K; Footprint Ref: RES0402_0-5; Tolerance: 5%; Wattage: 1/10W; Package: 0402; Distributor_name: DIGIKEY; Distributor_part_number: P200KJCT-ND; Library Ref: RESISTOR; Height: 0.40MM; Weight: 0.8mg; Temperature: -55°C+155°C; Datasheet: Y:\MIS_DATABASE\DATASHEETS\RESISTORS\PAN-ERJSER_NOV17.PDF; Crtd /date: USMAN/151013; Chkd/date: MANOJ/230414; MECHANICAL 3D STEP FILE: RES0402_0-5; Library Path: Y:\MIS_DATABASE\Library\ALTIUM_TOOL\SCHEMATICS_PARTS\MS_DISCRETE_Library.schlib; Footprint Path: Y:\MIS_DATABASE\Library\ALTIUM_TOOL\PCB_FOOTPRINTS\Altium_Footprint_Lib.PcbLib; PCB Footprint: RES0402_0-5
R88 = RESISTOR_Dup2: RES 200K 1/10W 5% 0402; Part Reference: R88; Part_type: RESISTORS\FIXED; Mfr_part_number: ERJ-2GEJ204X; Mfr_name: PANASONIC-ECG; Mistral Part No: 110013100006-R; Custom_Duty: 15%; Customs_HS_Code: 85332119; Voltage: NA; Project: C-BAND_SYNTH; Value: 200K; Footprint Path: Y:\MIS_DATABASE\Library\ALTIUM_TOOL\PCB_FOOTPRINTS\Altium_Footprint_Lib.PcbLib; Library Path: Y:\MIS_DATABASE\Library\ALTIUM_TOOL\SCHEMATICS_PARTS\MS_DISCRETE_Library.schlib; MECHANICAL 3D STEP FILE: RES0402_0-5; Chkd/date: MANOJ/230414; Crtd /date: USMAN/151013; Datasheet: Y:\MIS_DATABASE\DATASHEETS\RESISTORS\PAN-ERJSER_NOV17.PDF; Temperature: -55°C+155°C; Weight: 0.8mg; Height: 0.40MM; Library Ref: RESISTOR; Distributor_part_number: P200KJCT-ND; Distributor_name: DIGIKEY; Package: 0402; Wattage: 1/10W; Tolerance: 5%; Footprint Ref: RES0402_0-5; PCB Footprint: RES0402_0-5
R89 = RESISTOR_Dup2: RES 200K 1/10W 5% 0402; Part Reference: R89; Mistral Part No: 110013100006-R; Mfr_name: PANASONIC-ECG; Mfr_part_number: ERJ-2GEJ204X; Part_type: RESISTORS\FIXED; Project: C-BAND_SYNTH; Voltage: NA; Customs_HS_Code: 85332119; Custom_Duty: 15%; Value: 200K; Footprint Ref: RES0402_0-5; Tolerance: 5%; Wattage: 1/10W; Package: 0402; Distributor_name: DIGIKEY; Distributor_part_number: P200KJCT-ND; Library Ref: RESISTOR; Height: 0.40MM; Weight: 0.8mg; Temperature: -55°C+155°C; Datasheet: Y:\MIS_DATABASE\DATASHEETS\RESISTORS\PAN-ERJSER_NOV17.PDF; Crtd /date: USMAN/151013; Chkd/date: MANOJ/230414; MECHANICAL 3D STEP FILE: RES0402_0-5; Library Path: Y:\MIS_DATABASE\Library\ALTIUM_TOOL\SCHEMATICS_PARTS\MS_DISCRETE_Library.schlib; Footprint Path: Y:\MIS_DATABASE\Library\ALTIUM_TOOL\PCB_FOOTPRINTS\Altium_Footprint_Lib.PcbLib; PCB Footprint: RES0402_0-5
R90 = RESISTOR_Dup2: RES 10K 1/20W 5% 0201; Part Reference: R90; Part_type: RESISTORS\FIXED; Mfr_part_number: RC0201JR-0710KL; Mfr_name: YAGEO AMERICA; Mistral Part No: 110010070051-R; Custom_Duty: 15%; Customs_HS_Code: 85332119; Voltage: NA; Project: GOLDEN-I LITE; Value: 10K; MECHANICAL 3D STEP FILE: RES0201_0-5; Chkd/date: MANIRAJA/050517; Crtd /date: MANIRAJA/050517; Datasheet: Y:\MIS_DATABASE\DATASHEETS\RESISTORS\RCXXXXL-SER_MAR18.PDF; Temperature: -55°C+125°C; Weight: 0.17mg; Height: 0.26MM; Distributor_part_number: 311-10KNCT-ND; Distributor_name: DIGIKEY; Package: 0201; Wattage: 1/20W; Tolerance: 5%; Library Ref: RESISTOR; Footprint Ref: RES0201_0-5; Library Path: Y:\MIS_DATABASE\Library\ALTIUM_TOOL\SCHEMATICS_PARTS\MS_DISCRETE_Library.schlib; Footprint Path: Y:\MIS_DATABASE\Library\ALTIUM_TOOL\PCB_FOOTPRINTS\Altium_Footprint_Lib.PcbLib; PCB Footprint: RES0201_0-5
R92 = RESISTOR_Dup2: RES 909K 1/16W 1% 0402; Part Reference: R92; Cust_part_number: 4700-80053E; Mistral Part No: 110011050007-R; Mfr_name: VISHAY; Mfr_part_number: CRCW0402909KFKED; Part_type: RESISTORS\FIXED; Project: ITS-SINGAL_COND_CARD; Voltage: NA; Customs_HS_Code: 85332119; Custom_Duty: 15%; Value: 909K_1%; Footprint Path: Y:\MIS_DATABASE\Library\ALTIUM_TOOL\PCB_FOOTPRINTS\Altium_Footprint_Lib.PcbLib; Library Path: Y:\MIS_DATABASE\Library\ALTIUM_TOOL\SCHEMATICS_PARTS\MS_DISCRETE_Library.schlib; MECHANICAL 3D STEP FILE: RES0402_0-5; Footprint Ref: RES0402_0-5; Tolerance: 1%; Wattage: 1/16W; Package: 0402; Distributor_name: DIGIKEY; Distributor_part_number: 541-909KLCT-ND; Library Ref: RESISTOR; Height: 0.40MM; Weight: 0.65mg; Temperature: -55°C+155°C; Datasheet: Y:\MIS_DATABASE\DATASHEETS\RESISTORS\CRCW0603.PDF; Crtd /date: BAVISH/100511; Chkd/date: RAGESH/110511; PCB Footprint: RES0402_0-5
R94 = RESISTOR_Dup2: RES 499K 1/10W 1% 0402; Part Reference: R94; Mistral Part No: 110021020012-R; Mfr_name: PANASONIC-ECG; Mfr_part_number: ERJ-2RKF4993X; Part_type: RESISTORS\FIXED; Project: MSU_BRD; Voltage: NA; Customs_HS_Code: 85332119; Custom_Duty: 15%; Value: 499K_1%; Footprint Ref: RES0402_0-5; Tolerance: 1%; Wattage: 1/10W; Package: 0402; Distributor_name: DIGIKEY; Distributor_part_number: P499KLCT-ND; Library Ref: RESISTOR; Height: 0.40MM; Weight: 0.8mg; Temperature: -55°C+155°C; Datasheet: Y:\MIS_DATABASE\DATASHEETS\RESISTORS\PAN-ERJSER_NOV17.PDF; Crtd /date: MANIRAJA/110221; Chkd/date: ALVY/110221; MECHANICAL 3D STEP FILE: RES0402_0-5; Library Path: Y:\MIS_DATABASE\Library\ALTIUM_TOOL\SCHEMATICS_PARTS\MS_DISCRETE_Library.schlib; Footprint Path: Y:\MIS_DATABASE\Library\ALTIUM_TOOL\PCB_FOOTPRINTS\Altium_Footprint_Lib.PcbLib; PCB Footprint: RES0402_0-5
R95 = RESISTOR_Dup2: RES 10K 1/16W 5% 0402; Part Reference: R95; Part_type: RESISTORS\FIXED; Mfr_part_number: RC0402JR-0710KL; Mfr_name: YAGEO AMERICA; Mistral Part No: 110011060021-R; Custom_Duty: 15%; Customs_HS_Code: 85332119; Voltage: NA; Project: HSE; Value: 10K; Footprint Path: Y:\MIS_DATABASE\Library\ALTIUM_TOOL\PCB_FOOTPRINTS\Altium_Footprint_Lib.PcbLib; Library Path: Y:\MIS_DATABASE\Library\ALTIUM_TOOL\SCHEMATICS_PARTS\MS_DISCRETE_Library.schlib; Footprint Ref: RES0402_0-5; Library Ref: RESISTOR; Chkd/date: VASANTHA/061216; Crtd /date: MAZHAR/230805; Datasheet: Y:\MIS_DATABASE\DATASHEETS\RESISTORS\RCXXXXL-SER_MAR18.PDF; Temperature: -55°C+155°C; Weight: 0.65mg; Height: 0.40MM; Distributor_part_number: 311-10KJRCT-ND; Distributor_name: DIGIKEY; Package: 0402; Wattage: 1/16W; Tolerance: 5%; MECHANICAL 3D STEP FILE: RES0402_0-5; PCB Footprint: RES0402_0-5
R97 = RESISTOR_Dup2: RES 10K 1/16W 5% 0402; Part Reference: R97; Mistral Part No: 110011060021-R; Mfr_name: YAGEO AMERICA; Mfr_part_number: RC0402JR-0710KL; Part_type: RESISTORS\FIXED; Project: HSE; Voltage: NA; Customs_HS_Code: 85332119; Custom_Duty: 15%; Value: 10K; Footprint Path: Y:\MIS_DATABASE\Library\ALTIUM_TOOL\PCB_FOOTPRINTS\Altium_Footprint_Lib.PcbLib; Library Path: Y:\MIS_DATABASE\Library\ALTIUM_TOOL\SCHEMATICS_PARTS\MS_DISCRETE_Library.schlib; Footprint Ref: RES0402_0-5; Library Ref: RESISTOR; Tolerance: 5%; Wattage: 1/16W; Package: 0402; Distributor_name: DIGIKEY; Distributor_part_number: 311-10KJRCT-ND; Height: 0.40MM; Weight: 0.65mg; Temperature: -55°C+155°C; Datasheet: Y:\MIS_DATABASE\DATASHEETS\RESISTORS\RCXXXXL-SER_MAR18.PDF; Crtd /date: MAZHAR/230805; Chkd/date: VASANTHA/061216; MECHANICAL 3D STEP FILE: RES0402_0-5; PCB Footprint: RES0402_0-5
R131 = RESISTOR_Dup2: RES 10K 1/16W 5% 0402; Part Reference: R131; Mistral Part No: 110011060021-R; Mfr_name: YAGEO AMERICA; Mfr_part_number: RC0402JR-0710KL; Part_type: RESISTORS\FIXED; Project: HSE; Voltage: NA; Customs_HS_Code: 85332119; Custom_Duty: 15%; Value: 10K; Footprint Path: Y:\MIS_DATABASE\Library\ALTIUM_TOOL\PCB_FOOTPRINTS\Altium_Footprint_Lib.PcbLib; Library Path: Y:\MIS_DATABASE\Library\ALTIUM_TOOL\SCHEMATICS_PARTS\MS_DISCRETE_Library.schlib; Footprint Ref: RES0402_0-5; Library Ref: RESISTOR; Tolerance: 5%; Wattage: 1/16W; Package: 0402; Distributor_name: DIGIKEY; Distributor_part_number: 311-10KJRCT-ND; Height: 0.40MM; Weight: 0.65mg; Temperature: -55°C+155°C; Datasheet: Y:\MIS_DATABASE\DATASHEETS\RESISTORS\RCXXXXL-SER_MAR18.PDF; Crtd /date: MAZHAR/230805; Chkd/date: VASANTHA/061216; MECHANICAL 3D STEP FILE: RES0402_0-5; PCB Footprint: RES0402_0-5
R197 = RESISTOR_Dup2: RES 73.2K 1/16W 1% 0402; Part Reference: R197; Mistral Part No: 110009031097-R; Mfr_name: VISHAY; Mfr_part_number: CRCW040273K2FKED; Part_type: RESISTORS\FIXED; Project: OMAP_EVM; Voltage: NA; Customs_HS_Code: 85332119; Custom_Duty: 15%; Value: 73.2K_1%; Footprint Ref: RES0402_0-5; Tolerance: 1%; Wattage: 1/16W; Package: 0402; Distributor_name: DIGIKEY; Distributor_part_number: 541-73.2KLCT-ND; Library Ref: RESISTOR; Height: 0.40MM; Weight: 0.65mg; Temperature: -55°C+155°C; Datasheet: Y:\MIS_DATABASE\DATASHEETS\RESISTORS\CRCW0603.PDF; Crtd /date: USMAN/060109; Chkd/date: MAZHAR/130709; MECHANICAL 3D STEP FILE: RES0402_0-5; Library Path: Y:\MIS_DATABASE\Library\ALTIUM_TOOL\SCHEMATICS_PARTS\MS_DISCRETE_Library.schlib; Footprint Path: Y:\MIS_DATABASE\Library\ALTIUM_TOOL\PCB_FOOTPRINTS\Altium_Footprint_Lib.PcbLib; PCB Footprint: RES0402_0-5
U17 = TUSB321RWB_X2QFN12_TI: IC USB TYPE-C CH LOGIC AND PORT CONTROL WITH VCONN X2QFN12; Part Reference: U17; Part_type: ICS\INTERFACE; Mfr_name: TEXAS INSTRUMENTS; Mistral Part No: 141018060007-R; Custom_Duty: 15%; Customs_HS_Code: 85423100; Wattage: NA; Project: TI_J7SVB_USB_ADD-ON-CARD; Value: TUSB321RWBR; Footprint Path: Y:\MIS_DATABASE\Library\ALTIUM_TOOL\PCB_FOOTPRINTS\Altium_Footprint_Lib.PcbLib; Library Path: Y:\MIS_DATABASE\Library\ALTIUM_TOOL\SCHEMATICS_PARTS\MS_MISCINTERFACE_Library.schlib; MECHANICAL 3D STEP FILE: X2QFN12_TUSB322I_60X60_0-4; Chkd/date: MANIRAJA/140618; Crtd /date: ALVY/130618; Datasheet: Y:\MIS_DATABASE\DATASHEETS\ICS\INTERFACE\TUSB321.PDF; Temperature: 0°C+70°C; Weight: 5mg; Height: 0.40MM; Library Ref: TUSB321RWB_X2QFN12; Distributor_part_number: 296-42400-1-ND; Distributor_name: DIGIKEY; Package: X2QFN12; Voltage: NA; Tolerance: NA; Mfr_part_number: TUSB321RWBR; Footprint Ref: X2QFN12_TUSB322I_60X60_0-4; PCB Footprint: X2QFN12_TUSB322I_60X60_0-4
U23 = HD3SS3212IRKSR_VQFN20: IC 2:1 2-CHANNEL MUX/DEMUX DIFFERENTIAL USB VQFN20; Part Reference: U23; Part_type: ICS\DIGITAL\COMBINATIONAL; Mfr_name: TEXAS INSTRUMENTS; Mistral Part No: 141016040007-R; Custom_Duty: 15%; Customs_HS_Code: 85423100; Wattage: NA; Project: RZ/G1E_CARRIER_BOARD; Value: HD3SS3212IRKSR; Footprint Path: Y:\MIS_DATABASE\Library\ALTIUM_TOOL\PCB_FOOTPRINTS\Altium_Footprint_Lib.PcbLib; Library Path: Y:\MIS_DATABASE\Library\ALTIUM_TOOL\SCHEMATICS_PARTS\MS_COMBINATIONAL_Library.schlib; MECHANICAL 3D STEP FILE: VQFN20_HD3SS3212_100X180_1; Chkd/date: JEBRAN/250416; Crtd /date: VASANTHA/190416; Datasheet: Y:\MIS_DATABASE\DATASHEETS\ICS\DIGITAL\COMBINATIONAL\HD3SS3212.PDF; Temperature: -40°C+85°C; Weight: 70mg; Height: 1.00MM; Library Ref: HD3SS3212IRKSR_VQFN20; Distributor_part_number: 296-42306-1-ND; Distributor_name: DIGIKEY; Package: VQFN20; Voltage: NA; Tolerance: NA; Mfr_part_number: HD3SS3212IRKSR; Footprint Ref: VQFN20_HD3SS3212_100X180_1; PCB Footprint: VQFN20_HD3SS3212_100X180_1
U38 = TPS2556DRBT_SON8: IC ADJ CURRENT LIMITED POWER DISTRIBUTION SWITCHES SON8; Part Reference: U38; Mistral Part No: 142018050015-R; Mfr_name: TEXAS INSTRUMENTS; Mfr_part_number: TPS2557DRBT; Part_type: ICS\POWER\MANAGEMENT; Project: TI_MAXIE_EVM-JIG; Tolerance: NA; Customs_HS_Code: 85423100; Custom_Duty: 15%; Value: TPS2557; Footprint Ref: SON8_25-59_130X130_1; Voltage: NA; Wattage: NA; Package: SON8; Distributor_name: DIGIKEY; Distributor_part_number: 296-25432-1-ND; Library Ref: TPS2556DRBT_SON8; Height: 1.00MM; Weight: 24mg; Temperature: -40°C+85°C; Datasheet: Y:\MIS_DATABASE\DATASHEETS\ICS\POWER\TPS255XX.PDF; Crtd /date: ALVY/280518; Chkd/date: MANIRAJA/280518; MECHANICAL 3D STEP FILE: SON8_25-59_130X130_1; Library Path: Y:\MIS_DATABASE\Library\ALTIUM_TOOL\SCHEMATICS_PARTS\MS_MISCPOWER_Library.schlib; Footprint Path: Y:\MIS_DATABASE\Library\ALTIUM_TOOL\PCB_FOOTPRINTS\Altium_Footprint_Lib.PcbLib; PCB Footprint: SON8_25-59_130X130_1
U40 = SN74LVC1G04DRLR_SOT553-5: IC SINGLE INVERTER GATE SOT553-5; Part Reference: U40; Mistral Part No: 141009030225-R; Mfr_name: TEXAS INSTRUMENTS; Part_type: ICS\DIGITAL\GATES; Project: SMART VIEW_IP CAMERA; Customs_HS_Code: 85423100; Custom_Duty: 15%; Value: SN74LVC1G04DRLR; Mfr_part_number: SN74LVC1G04DRLR; Package: SOT553-5; Distributor_name: DIGIKEY; Distributor_part_number: 296-18008-1-ND; Library Ref: SN74LVC1G04DRLR_SOT553-5; Height: 0.60MM; Datasheet: Y:\MIS_DATABASE\DATASHEETS\ICS\DIGITAL\GATES\SN74LVC1G04-1.PDF; Crtd /date: USMAN/110208; Chkd/date: MAZHAR/110208; Stock: nil; RoHS: Sb/ Br FREE; PCB Footprint: SOT553-5
U93 = SN74LVC1G08DBVRE4_SOT23-5: IC SINGLE 2-INPUT POSITIVE AND GATE SOT23-5; Part Reference: U93; Part_type: ICS\DIGITAL\GATES; Mfr_name: TEXAS INSTRUMENTS; Mistral Part No: 141009060026-R; Automotive Alternate_mfr_part_number: SN74LVC1G08QDBVRQ1; Custom_Duty: 15%; Customs_HS_Code: 85423100; Project: KHAN_MAIN; Value: SN74LVC1G08DBVRE4; RoHS: Sb/ Br FREE; Chkd/date: SUHAS/221010; Crtd /date: USMAN/151008; Datasheet: Y:\MIS_DATABASE\DATASHEETS\ICS\DIGITAL\GATES\SN74LVC1G08.PDF; Temperature: -40°C+85°C; Height: 1.45MM; Library Ref: SN74LVC1G08DBVRE4_SOT23-5; Distributor_part_number: SN74LVC1G08DBVRE4-ND; Distributor_name: DIGIKEY; Package: SOT23-5; Mfr_part_number: SN74LVC1G08DBVRE4; Automotive Alternate_mfr_name: TEXAS INSTRUMENTS; PCB Footprint: SOT23-5